# Altium project ArduinoUNO.PrjPcb
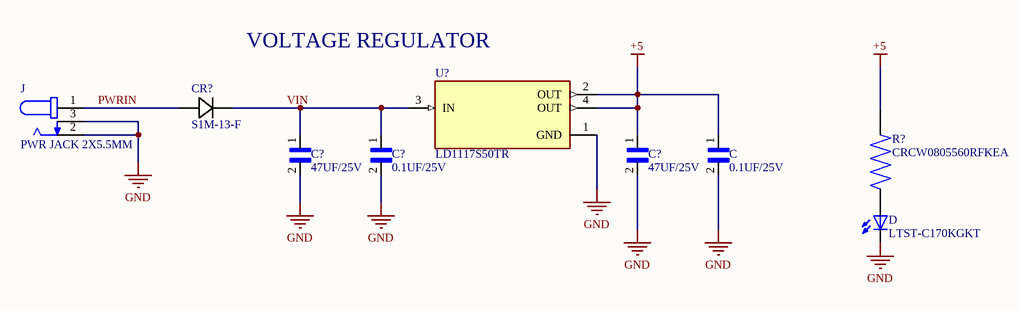
[diagram p0: ArduinoUno_v1.0.SchDoc]
1 sheet, 9 parts. Net scope: global (net labels, ports and power ports of the same name join across sheets).

## Sheet ArduinoUno_v1.0.SchDoc
size A; SheetNumber: 1; SheetTotal: 1

### Parts
(Parts that share a designator on the sheet are numbered #1, #2 ... from top to bottom, then left to right.)
C  0.1UF/25V  [CAPC1608X90N]
C?#1  47UF/25V  [CAPC3216X180N]
C?#2  0.1UF/25V  [CAPC1608X90N]
C?#3  47UF/25V  [CAPC3216X180N]
CR?  S1M-13-F  [SMA_DIO]
D  LTST-C170KGKT  [DIOC200X125X110]
J  PWR JACK 2X5.5MM  [CUI_PJ-006A-SMT]
R?  CRCW0805560RFKEA  [RESC2012X50N]
U?  LD1117S50TR  [SOT230P700X180-4N]

### Nets
+5: C.1 C?#3.1 R?.2 U?.2(OUT) U?.4(OUT)
GND: C.2 C?#1.2 C?#2.2 C?#3.2 D.NEG J.2 J.3 U?.1(GND)
PWRIN: CR?.2 J.1
VIN: C?#1.1 C?#2.1 CR?.1 U?.3(IN)

Not connected (* = marked no-connect by the designer): D POS; R? 1

### Notes on the sheet
- VOLTAGE REGULATOR

### Library data of the parts
C C?#2 = 06033C104JAT2A: 0.1ÂµF Â±5% 25V Ceramic Capacitor X7R 0603 _1608 Metric_; MF: AVX; SnapEDA_Link: https://www.snapeda.com/parts/06033C104JAT2A/AVX/view-part/605908/?ref=snap; MP: 06033C104JAT2A; Digi-Key_Part_Number: 478-3713-1-ND; Value: *; Package: 1608 AVX; Digi-Key_Purchase_URL: https://www.digikey.com/product-detail/en/avx-corporation/06033C104JAT2A/478-3713-1-ND/1116411?utm_source=snapeda&utm_medium=aggregator&utm_campaign=symbol
C?#1 C?#3 = C3216JB1E476M160AC: Cap Ceramic 47uF 25V JB 20% SMD 1206 85C T/R; Package: None; Price: None; Value: *; MP: C3216JB1E476M160AC; Availability: Unavailable
CR? = S1M-13-F: No Description Available; Vendor: Diodes Inc; Built_By: EMA_UL_Team; SourceLibrary: DiodesInc_2015-05-08; Type: DEV; Manufacturer_Part_Number: S1M-13-F; Copyright: Copyright (C) 2018 Accelerated Designs. All rights reserved; RefDes: RefDes
D = LTST-C170KGKT: Green 571nm LED Indication - Discrete 2V 0805 (2012 Metric); MF: Lite-On Inc.; SnapEDA_Link: https://www.snapeda.com/parts/LTST-C170KGKT/Lite-On%20Inc./view-part/51978/?ref=snap; MP: LTST-C170KGKT; Package: 0805 Lite-On; Mouser-Purchase-URL: https://snapeda.com/shop?store=Mouser&id=51978; Arrow_Electronics-Purchase-URL: https://snapeda.com/shop?store=Arrow+Electronics&id=51978; Availability: Unavailable; Price: None; Value: *; DigiKey-Purchase-URL: https://snapeda.com/shop?store=DigiKey&id=51978
J = PJ-006A-SMT: 2.0 x 6.3 mm, 2.5 A, Vertical, Surface Mount _SMT_, Dc Power Jack Connector; MF: CUI Devices; Package: None; MP: PJ-006A-SMT; SnapEDA_Link: https://www.snapeda.com/parts/PJ-006A-SMT/CUI%20Devices/view-part/2772229/?ref=snap; Price: None; Value: *; Availability: Unavailable
R? = CRCW0805560RFKEA: Resistor; Thick Film; 560 Ohms; 0.125 W; 1%; SMT; 0805; TCR 37 ppm/DegC; Tape and Reel; MF: Vishay; Digi-Key_Part_Number: 541-560CCT-ND; SnapEDA_Link: https://www.snapeda.com/parts/CRCW0805560RFKEA/Vishay/view-part/919620/?ref=snap; Package: 2012 Vishay; MP: CRCW0805560RFKEA; Value: *; Check_prices: https://www.snapeda.com/parts/CRCW0805560RFKEA/Vishay/view-part/919620/?ref=eda; Purchase-URL: https://pricing.snapeda.com/search/part/CRCW0805560RFKEA/?ref=eda
U? = LD1117S50TR: Linear Voltage Regulator IC 1 Output 800mA SOT-223; MF: STMicroelectronics; SnapEDA_Link: https://www.snapeda.com/parts/LD1117S50TR/STMicroelectronics/view-part/46893/?ref=snap; Price: None; Value: *; MP: LD1117S50TR; Check_prices: https://www.snapeda.com/parts/LD1117S50TR/STMicroelectronics/view-part/46893/?ref=eda; Availability: Good; Package: SOT-223 STMicroelectronics; Purchase-URL: https://pricing.snapeda.com/search/part/LD1117S50TR/?ref=eda